# EAGLE schematic LED Blink v8 (EAGLE 9.7.0)
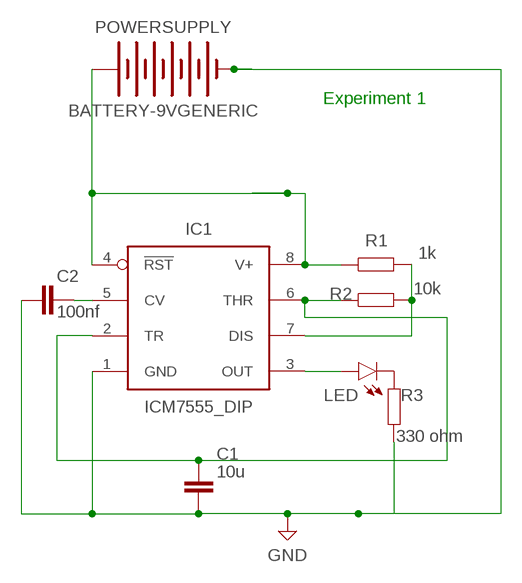
[diagram p0: schematic, sheet 1]

## Parts
C1  10u  C_CHIP-0402(1005-METRIC)  [CAPC1005X60]
C2  100nf  C_CHIP-0402(1005-METRIC)  [CAPC1005X60]
IC1  ICM7555_DIP  [DIP826W53P254L959H508Q8B]
LED  CHIP-FLAT-B_0603-0.35MM  [LEDC1608X35N_FLAT-B]
POWERSUPPLY  BATTERY-9VGENERIC  [BATTERY-GENERIC]
R1  1k  R_CHIP-0402(1005-METRIC)  [RESC1005X40]
R2  10k  R_CHIP-0402(1005-METRIC)  [RESC1005X40]
R3  330 ohm  R_CHIP-0402(1005-METRIC)  [RESC1005X40]

## Nets
GND: C1.2 C2.2 IC1.1(GND) POWERSUPPLY.- R3.1
N$1: IC1.4(!RST) IC1.8(V+) POWERSUPPLY.+ R1.1
N$2: LED.C R3.2
N$3: C2.1 IC1.5(CV)
N$4: C1.1 IC1.2(TR) IC1.6(THR) R2.1
N$5: IC1.7(DIS) R1.2 R2.2
N$6: IC1.3(OUT) LED.A

## Notes on the sheet
- Experiment 1

## Library data of the parts
C1 C2 = Capacitor:C: Capacitor - Generic; CATEGORY: Capacitor; PACKAGE_SIZE: 0402; PACKAGE_TYPE: SMD; SUBCATEGORY: Ceramic Capacitors; TYPE: MLCC
IC1 = IC_Clock-Timing:*555: TIMER 555 General purpose precision timers NE555 : Texas Datasheet <http://www.ti.com/general/docs/suppproductinfo.tsp?distId=10&gotoUrl=http%3A%2F%2Fwww.ti.com%2Flit%2Fgpn%2Fne555>, Diodes Incorporated Datasheet <https://www.diodes.com/assets/Datasheets/NE555_SA555_NA555.pdf> LM555 Datasheet <http://www.ti.com/general/docs/suppproductinfo.tsp?distId=10&gotoUrl=http%3A%2F%2Fwww.ti.com%2Flit%2Fgpn%2Flm555> LMC555 Datasheet <http://www.ti.com/general/docs/suppproductinfo.tsp?distId=10&gotoUrl=http%3A%2F%2Fwww.ti.com%2Flit%2Fgpn%2Flmc555> ICM7555 : Maxim Integrated Datasheet <https://datasheets.maximintegrated.com/en/ds/ICM7555-ICM7556.pdf>, Renesas Electronics America Inc Datasheet <https://www.renesas.com/en-us/www/doc/datasheet/icm7555-56.pdf>; CATEGORY: Clock/Timing; CURRENT_SUPPLY: 60 µA; DATASHEET: https://www.renesas.com/en/document/dst/icm7555-icm7556-datasheet; DESCRIPTION: 555 Type Timer/Oscillator (Single) IC 1 MHz 8-PDIP; FREQUENCY: 1 MHz; MANUFACTURER: Renesas Electronics Corporation; MPN: ICM7555IPAZ; OPERATING_TEMPERATURE: -25°C ~ 85°C; PACKAGE_SIZE: 8-PDIP; PACKAGE_TYPE: THT; PART_STATUS: ACTIVE; ROHS: COMPLIANT; SERIES: ICM7555; SUBCATEGORY: Programmable Timers and Oscillators; TYPE: 555 Type Single Precision Timer; VOLTAGE_SUPPLY: 2 V ~ 18 V
LED = LED:CHIP-FLAT-B: Blue LED - Generic; CATEGORY: LED; COLOR: Blue; DESCRIPTION: Blue LED Indication 0603 (1608 Metric); PACKAGE_SIZE: 0603; PACKAGE_TYPE: SMD; SUBCATEGORY: Chip LED; TYPE: Square with Flat Top
POWERSUPPLY = Tinkercad:BATTERY-9V
R1-R3 = Resistor:R: Resistor Fixed - Generic; CATEGORY: Resistors; DESCRIPTION: Chip Resistor 1.05 X 0.54 X 0.40 mm body 0402(1005-METRIC) Package; PACKAGE_SIZE: 0402; PACKAGE_TYPE: SMD